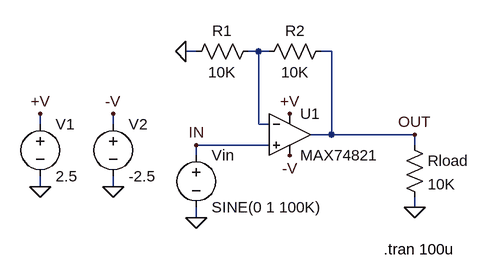
[diagram p0: schematic MAX74821.asc]
MAX74821.asc, the LTspice schematic file:
Version 4.1
SHEET 1 1240 700
WIRE 464 -1184 448 -1184
WIRE 560 -1184 544 -1184
WIRE 576 -1184 560 -1184
WIRE 672 -1184 656 -1184
WIRE 224 -1072 224 -1088
WIRE 336 -1072 336 -1088
WIRE 560 -1072 560 -1184
WIRE 576 -1072 560 -1072
WIRE 672 -1056 672 -1184
WIRE 672 -1056 640 -1056
WIRE 800 -1056 672 -1056
WIRE 576 -1040 464 -1040
WIRE 800 -1040 800 -1056
WIRE 464 -1024 464 -1040
WIRE 224 -976 224 -992
WIRE 336 -976 336 -992
WIRE 800 -944 800 -960
WIRE 464 -928 464 -944
FLAG 224 -1088 +V
FLAG 224 -976 0
FLAG 464 -928 0
FLAG 800 -1056 OUT
FLAG 464 -1040 IN
FLAG 608 -1088 +V
FLAG 336 -1088 -V
FLAG 608 -1024 -V
FLAG 448 -1184 0
FLAG 800 -944 0
FLAG 336 -976 0
SYMBOL voltage 464 -1040 R0
WINDOW 123 24 146 Left 2
WINDOW 39 24 125 Left 2
SYMATTR InstName Vin
SYMATTR Value SINE(0 1 100K)
SYMBOL voltage 224 -1088 R0
WINDOW 123 0 0 Left 2
WINDOW 39 0 0 Left 2
SYMATTR InstName V1
SYMATTR Value 2.5
SYMBOL res 560 -1200 R90
WINDOW 0 0 56 VBottom 2
WINDOW 3 32 56 VTop 2
SYMATTR InstName R1
SYMATTR Value 10K
SYMBOL res 672 -1200 R90
WINDOW 0 0 56 VBottom 2
WINDOW 3 32 56 VTop 2
SYMATTR InstName R2
SYMATTR Value 10K
SYMBOL voltage 336 -1088 R0
WINDOW 123 24 146 Left 2
WINDOW 39 24 125 Left 2
SYMATTR InstName V2
SYMATTR Value -2.5
SYMBOL res 784 -1056 R0
SYMATTR InstName Rload
SYMATTR Value 10K
SYMBOL MAX74821 608 -1120 R0
SYMATTR InstName U1
TEXT 752 -880 Left 2 !.tran 100u

The netlist it stands for:
* MAX74821.asc
Vin IN 0 SINE(0 1 100K)
V1 +V 0 2.5
R1 N001 0 10K
R2 OUT N001 10K
V2 -V 0 -2.5
Rload OUT 0 10K
* U1: MAX74821 (symbol MAX74821 not available, pins judged from their places): In+=IN In-=N001 V+=+V V-=-V OUT=OUT
.tran 100u
.backanno
.end